# Altium schematic sheet 扫描仪.SchDoc
size E; SheetNumber: 0; SheetTotal: 0
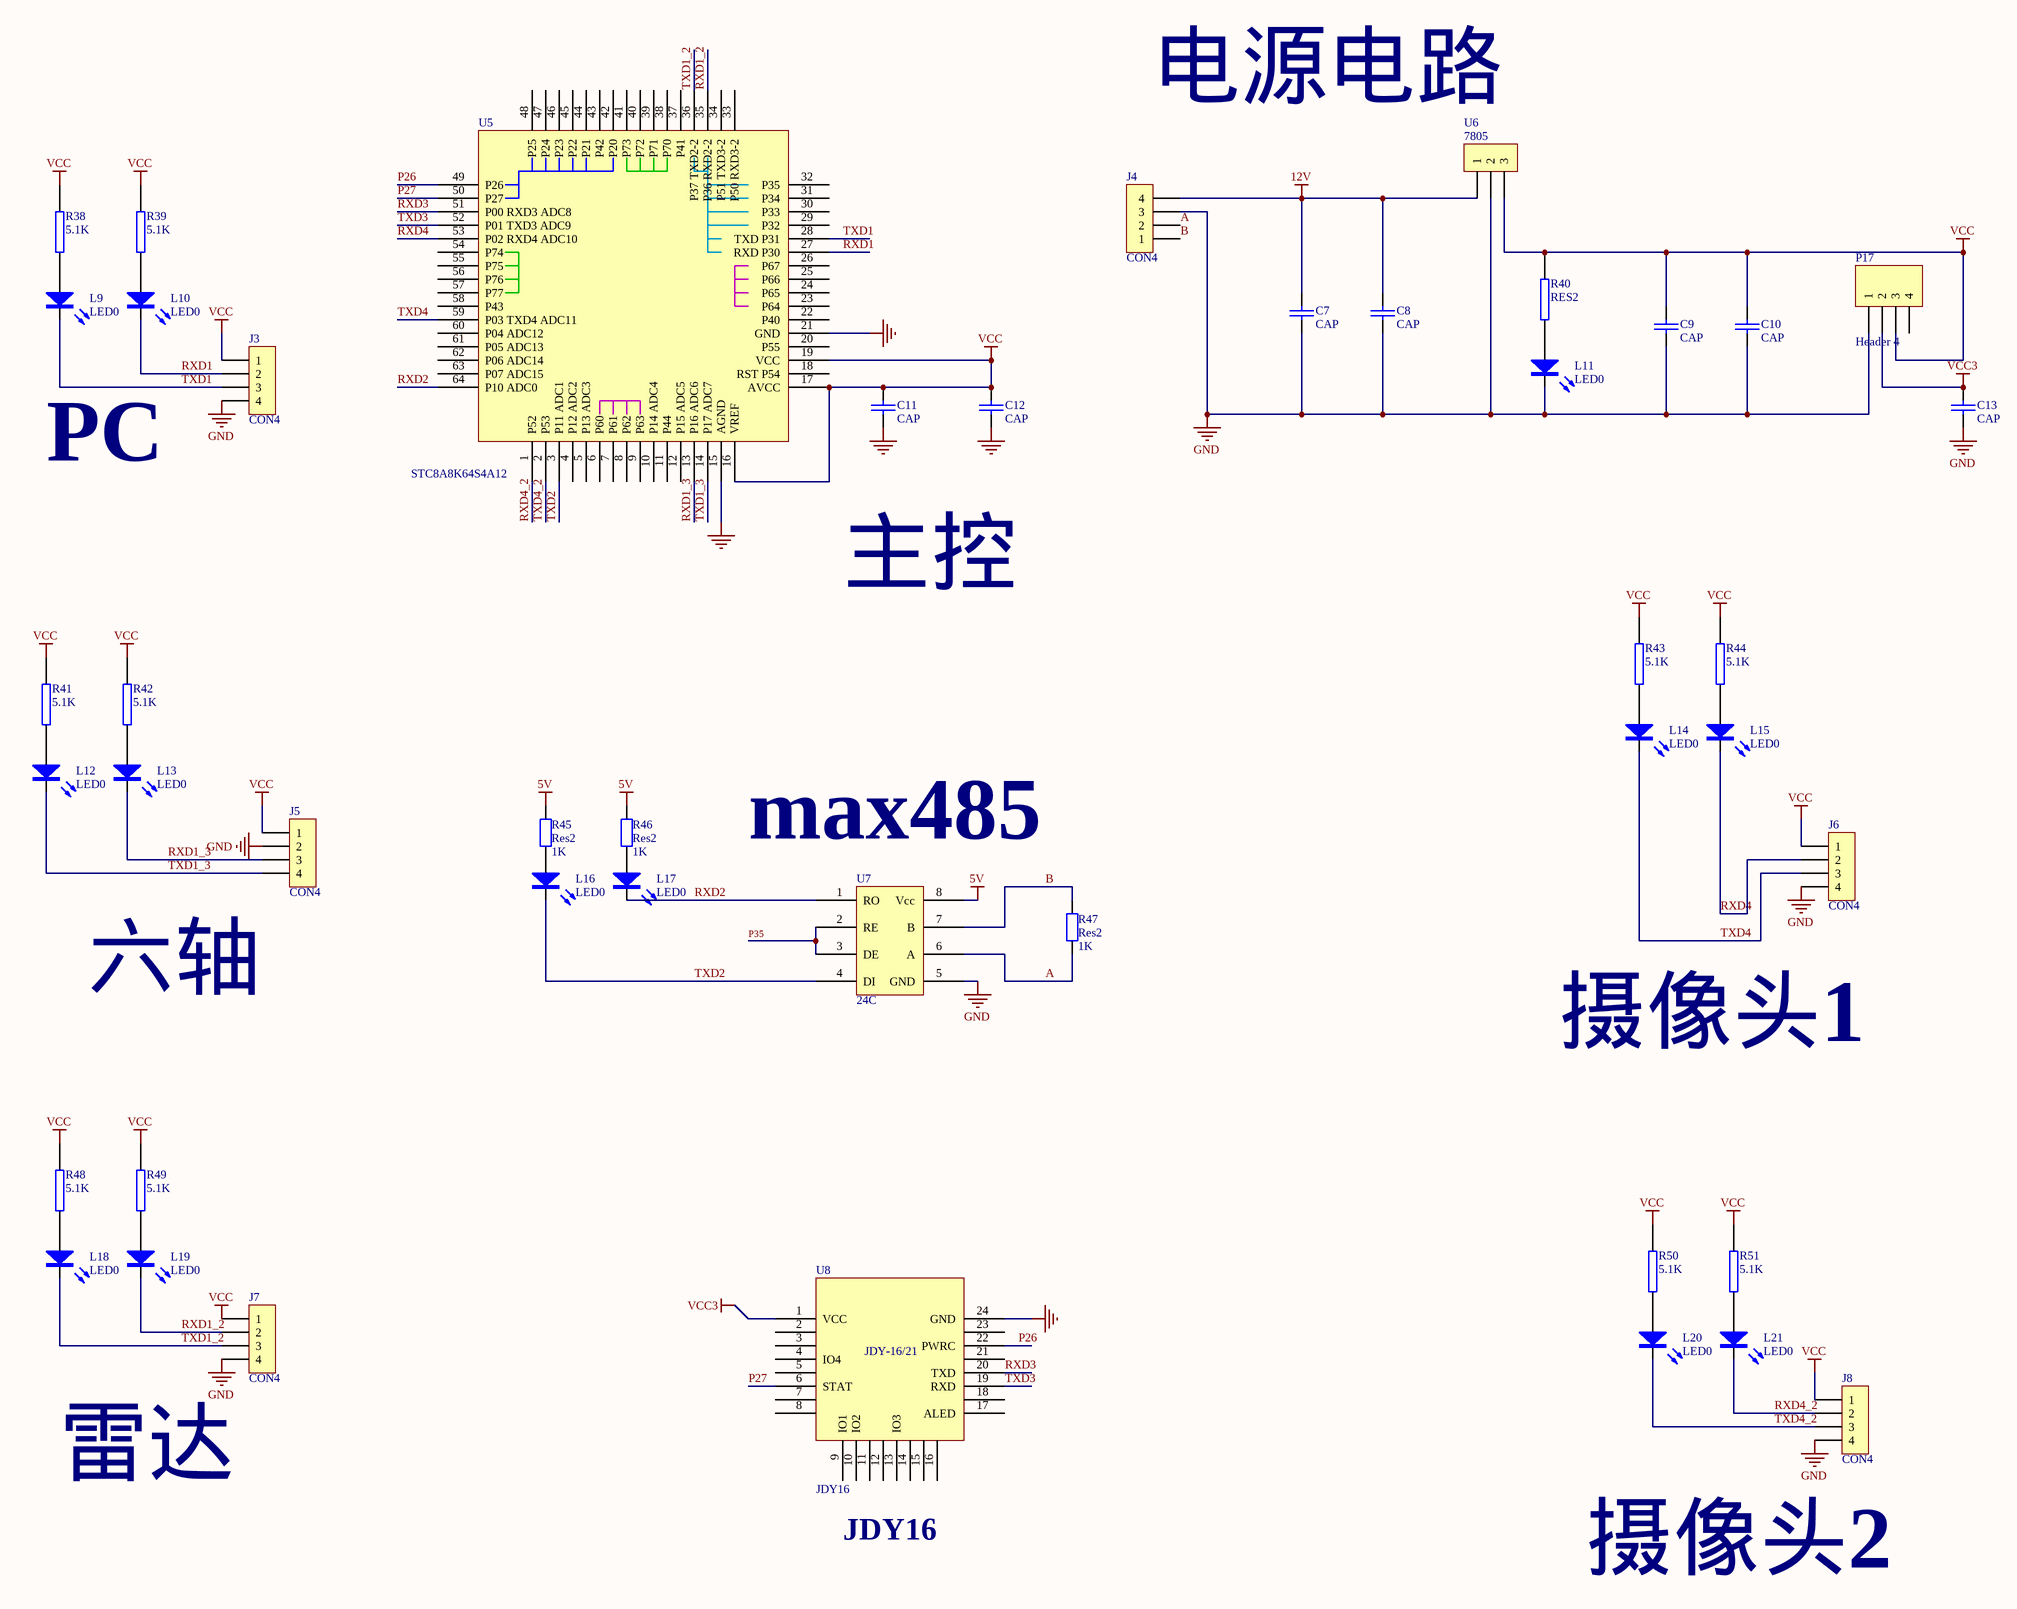
[diagram p0: 扫描仪.SchDoc]

## Parts
C7  CAP  [0805_L]
C8  CAP  [1206_L]
C9  CAP  [0805_L]
C10  CAP  [1206_L]
C11  CAP  [0805_L]
C12  CAP  [0805_L]
C13  CAP  [0805_L]
J3  CON4  [SP4]
J4  CON4  [SP4]
J5  CON4  [SP4]
J6  CON4  [SP4]
J7  CON4  [SP4]
J8  CON4  [SP4]
L9  LED0  [TPLED]
L10  LED0  [TPLED]
L11  LED0  [TPLED]
L12  LED0  [TPLED]
L13  LED0  [TPLED]
L14  LED0  [TPLED]
L15  LED0  [TPLED]
L16  LED0  [TPLED]
L17  LED0  [TPLED]
L18  LED0  [TPLED]
L19  LED0  [TPLED]
L20  LED0  [TPLED]
L21  LED0  [TPLED]
P17  Header 4  [1117]
R38  5.1K  [0805_L]
R39  5.1K  [0805_L]
R40  RES2  [0805_L]
R41  5.1K  [0805_L]
R42  5.1K  [0805_L]
R43  5.1K  [0805_L]
R44  5.1K  [0805_L]
R45  Res2  value 1K  [0805_R]
R46  Res2  value 1K  [0805_R]
R47  Res2  value 1K  [0805_R]
R48  5.1K  [0805_L]
R49  5.1K  [0805_L]
R50  5.1K  [0805_L]
R51  5.1K  [0805_L]
U5  STC8A8K64S4A12  [LQFP64S]
U6  7805  [TO252]
U7  24C  [SOP8]
U8  JDY16  [JDY16]

## Nets
5V: R45.2 R46.2 U7.8(Vcc)
12V: C7.1 C8.1 J4.4 U6.1
GND: C7.2 C8.2 C9.2 C10.2 C11.2 C12.2 C13.2 J3.4 J4.3 J5.2 J6.4 J7.4 J8.4 L11.2(K) P17.1 U5.15(AGND) U5.21(GND) U6.2 U7.5(GND) U8.24(GND)
VCC: C9.1 C10.1 C11.1 C12.1 J3.1 J5.1 J6.1 J7.1 J8.1 P17.3 R38.2 R39.2 R40.2 R41.2 R42.2 R43.2 R44.2 R48.2 R49.2 R50.2 R51.2 U5.16(VREF) U5.17(AVCC) U5.19(VCC) U6.3
VCC3: C13.1 P17.2 U8.1(VCC)
A: J4.2 R47.1 U7.6(A)
B: J4.1 R47.2 U7.7(B)
P26: U5.49(P26) U8.22(PWRC)
P27: U5.50(P27) U8.6(STAT)
P35: U7.2(RE) U7.3(DE)
RXD1: J3.2 L10.2(K) U5.27(RXD_P30)
RXD1_2: J7.2 L19.2(K) U5.35(P36_RXD2-2)
RXD1_3: J5.3 L13.2(K) U5.13(P16_ADC6)
RXD2: L17.2(K) U5.64(P10_ADC0) U7.1(RO)
RXD3: U5.51(P00_RXD3_ADC8) U8.20(TXD)
RXD4: J6.2 L15.2(K) U5.53(P02_RXD4_ADC10)
RXD4_2: J8.2 L21.2(K) U5.1(P52)
TXD1: J3.3 L9.2(K) U5.28(TXD_P31)
TXD1_2: J7.3 L18.2(K) U5.36(P37_TXD2-2)
TXD1_3: J5.4 L12.2(K) U5.14(P17_ADC7)
TXD2: L16.2(K) U5.3(P11_ADC1) U7.4(DI)
TXD3: U5.52(P01_TXD3_ADC9) U8.19(RXD)
TXD4: J6.3 L14.2(K) U5.59(P03_TXD4_ADC11)
TXD4_2: J8.3 L20.2(K) U5.2(P53)
NetL9_1: L9.1(A) R38.1
NetL10_1: L10.1(A) R39.1
NetL11_1: L11.1(A) R40.1
NetL12_1: L12.1(A) R41.1
NetL13_1: L13.1(A) R42.1
NetL14_1: L14.1(A) R43.1
NetL15_1: L15.1(A) R44.1
NetL16_1: L16.1(A) R45.1
NetL17_1: L17.1(A) R46.1
NetL18_1: L18.1(A) R48.1
NetL19_1: L19.1(A) R49.1
NetL20_1: L20.1(A) R50.1
NetL21_1: L21.1(A) R51.1

Not connected (* = marked no-connect by the designer): P17 4; U5 4(P12_ADC2) 5(P13_ADC3) 6(P60) 7(P61) 8(P62) 9(P63) 10(P14_ADC4) 11(P44) 12(P15_ADC5) 18(RST_P54) 20(P55) 22(P40) 23(P64) 24(P65) 25(P66) 26(P67) 29(P32) 30(P33) 31(P34) 32(P35) 33(P50_RXD3-2) 34(P51_TXD3-2) 37(P41) 38(P70) 39(P71) 40(P72) 41(P73) 42(P20) 43(P42) 44(P21) 45(P22) 46(P23) 47(P24) 48(P25) 54(P74) 55(P75) 56(P76) 57(P77) 58(P43) 60(P04_ADC12) 61(P05_ADC13) 62(P06_ADC14) 63(P07_ADC15); U8 2 3 4(IO4) 5 7 8 9(IO1) 10(IO2) 11 12 13(IO3) 14 15 16 17(ALED) 18 21 23

## Notes on the sheet
- 电源电路
- PC
- 主控
- (near U7) max485
- 六轴
- 摄像头1
- 雷达
- JDY16
- 摄像头2
- (in symbol JDY21) JDY-16/21

## Library data of the parts
C7-C13 = CAP: Capacitor
J3-J8 = CON4: Connector
L9-L21 = LED0: light Emitting Diode
P17 = Header 4: Header, 4-Pin; LatestRevisionDate: 17-Jul-2002; LatestRevisionNote: Re-released for DXP Platform.; Publisher: Altium Limited
R38 R39 R41-R44 R48-R51 = RES2
R45-R47 = Res2: Resistor; Published: 8-Jun-2000; LatestRevisionDate: 17-Jul-2002; LatestRevisionNote: Re-released for DXP Platform.; PackageReference: AXIAL-0.4; Publisher: Altium Limited; PackageDescription: Axial Device, Thru-Hole; 2 Leads; 0.4 in Pin Spacing
U5 = STC64
U6 = CON3: Connector
U8 = JDY21